# EAGLE design at86rf_mk2 (EAGLE 7.1.0)
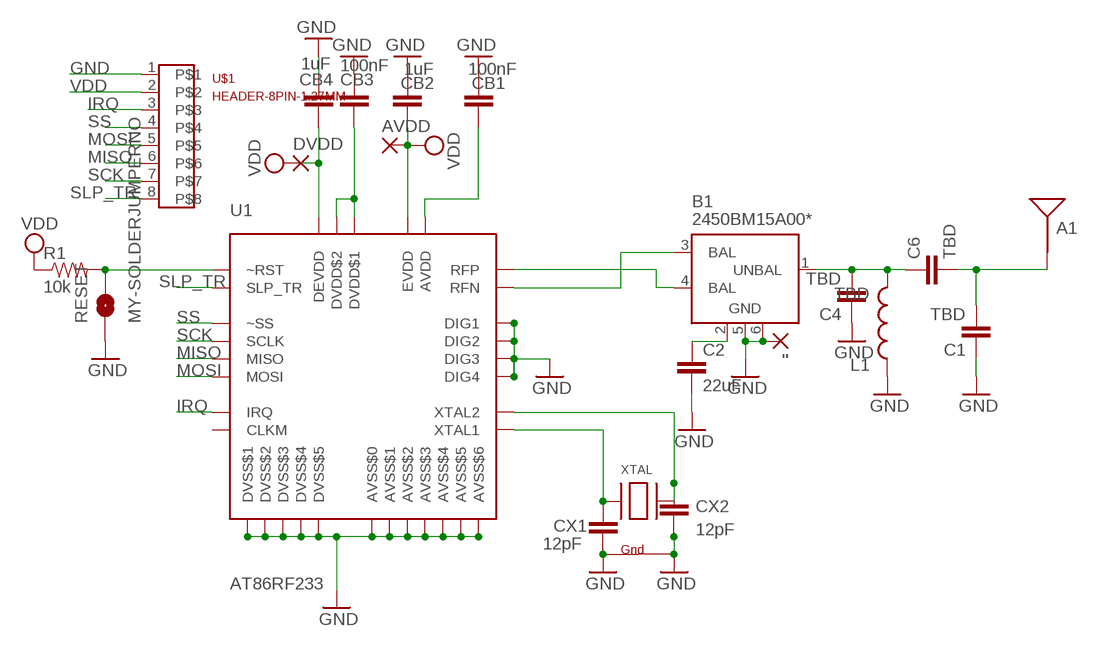
[diagram p0: schematic, sheet 1]

## Parts
'  VIAPADNOTHERMAL  [VIAPAD13MIL-NOTHERMAL]
''  VIAPADNOTHERMAL  [VIAPAD13MIL-NOTHERMAL]
A1  ANTENNA2SMD5  [ANTENNA-CHIP5]
AVDD  VIAPADNOPASTE  [PAD-1-NOPASTE]
B1  2450BM15A00*  2450BM15A00  [2450BM15A0002]
C1  TBD  CAP0402-CAP  [0402-CAP]
C2  22uF  CAP0402-CAP  [0402-CAP]
C4  TBD  CAP0402-CAP  [0402-CAP]
C6  TBD  CAP0402-CAP  [0402-CAP]
CB1  100nF  CAP0402-CAP  [0402-CAP]
CB2  1uF  CAP0603-CAP  [0603-CAP]
CB3  100nF  CAP0402-CAP  [0402-CAP]
CB4  1uF  CAP0603-CAP  [0603-CAP]
CX1  12pF  CAP0402-CAP  [0402-CAP]
CX2  12pF  CAP0402-CAP  [0402-CAP]
DVDD  VIAPADNOPASTE  [PAD-1-NOPASTE]
L1  TBD  INDUCTOR0402  [C0402]
R1  10k  RESISTOR0402-RES  [0402-RES]
RESET  MY-SOLDERJUMPERNO  [SJ_2S-NO]
U1  AT86RF233  AT86RF212BQFN32  [QFN-32]
U$1  HEADER-8PIN-1.27MM  [1X08-1.27MM]
XTAL  XTAL-4-3225  [NX3225]

## Nets
GND [power]: ''.1(P) '.1(P) B1.5(GND) B1.6(GND) C1.1 C2.2 C4.1 CB1.1 CB2.1 CB3.1 CB4.1 CX1.2 CX2.2 L1.1 RESET.1 U1.1(DIG3) U1.2(DIG4) U1.3(AVSS$1) U1.6(AVSS$2) U1.7(DVSS$1) U1.9(DIG1) U1.10(DIG2) U1.12(DVSS$2) U1.16(DVSS$3) U1.18(DVSS$4) U1.21(DVSS$5) U1.27(AVSS$3) U1.30(AVSS$4) U1.31(AVSS$5) U1.32(AVSS$6) U1.EP(AVSS$0) U$1.1 XTAL.2(G2) XTAL.4(G1)
IRQ: U1.24(IRQ) U$1.3
MISO: U1.20(MISO) U$1.6
MOSI: U1.22(MOSI) U$1.5
N$1: CB3.2 U1.13(DVDD$1) U1.14(DVDD$2)
N$2: CB1.2 U1.29(AVDD)
N$3: CX2.1 U1.25(XTAL2) XTAL.3(X2)
N$4: CX1.1 U1.26(XTAL1) XTAL.1(X1)
N$6: B1.3(BAL) U1.5(RFN)
N$7: B1.4(BAL) U1.4(RFP)
N$9 [100ohm unbal]: B1.1(UNBAL) C4.2 C6.1 L1.2
N$11: R1.2 RESET.2 U1.8(~RST)
N$14 [100ohm unbal]: A1.FEED(SIGNAL) C1.2 C6.2
N$15: B1.2(GND) C2.1
SCK: U1.19(SCLK) U$1.7
SLP_TR: U1.11(SLP_TR) U$1.8
SS: U1.23(~SS) U$1.4
VDD [power]: AVDD.P$1(P) CB2.2 CB4.2 DVDD.P$1(P) R1.1 U1.15(DEVDD) U1.28(EVDD) U$1.2
Unconnected: U1.17(CLKM)

## Library data of the parts
' '' AVDD DVDD = my library:VIAPAD: THROUGH-HOLE PAD
A1 = SparkFun-RF:ANTENNA2: Chip antenna Single endded antenna. Common with smaller chip antennas. CHIP4 package is the GPS Chip Antenna SKU: GPS-08418. CHIP5 package is 2.4GHz chip antenna SKU: WRL-00144.
B1 = my library:2450BM15A00**: 2.45 GHz Impedance Matched Balun-Filter For TI CC253X/CC2540 Chipset family Data sheet <http://www.johansontechnology.com/images/stories/ip/baluns/balun_filter_combo_matched_2450bm15a0002_v8.pdf>
C1 C2 C4 C6 = SparkFun-Passives:CAP: Capacitor Standard 0603 ceramic capacitor, and 0.1" leaded capacitor.
CB1-CB4 CX1 CX2 = SparkFun-Capacitors:CAP: Capacitor Standard 0603 ceramic capacitor, and 0.1" leaded capacitor.
L1 = SparkFun-Passives:INDUCTOR: Inductors Basic Inductor/Choke - 0603 and 1206. Footprints are not proven and vary greatly between part numbers.
R1 = SparkFun-Resistors:RESISTOR: Resistor Basic schematic elements and footprints for 0603, 1206, and PTH resistors.
RESET = my library:MY-SOLDERJUMPER: Solder Jumper Standard SMD solder jumper. Used to automate production. Two varients : Normally Open and Normally Closed are the same, but have different paste layers. NC will have a large amount of paste and should jumper during reflow.
U1 = Pinoccio:AT86RF212B
U$1 = my library:HEADER-8PIN-1.27MM
XTAL = adafruit:XTAL-4: Classic 4-pin 3.2 x 2.5mm crystal

## Net classes
1 50ohm bal: width 0.305 mm, clearance 0.203 mm
2 100ohm unbal: width 0.254 mm, clearance 0.406 mm

## Board
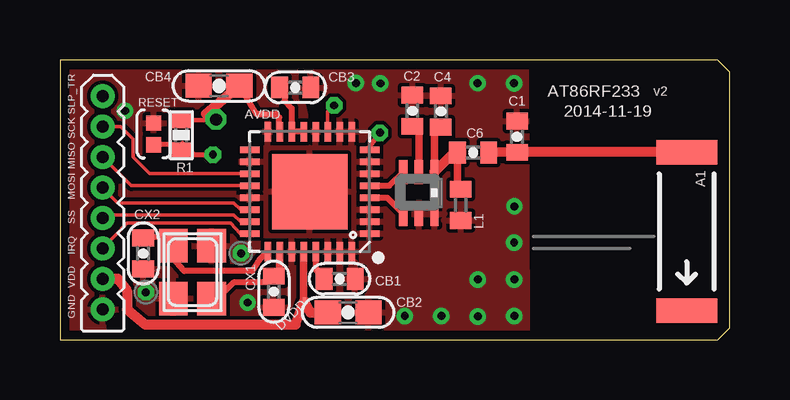
[diagram p1: board, top side]
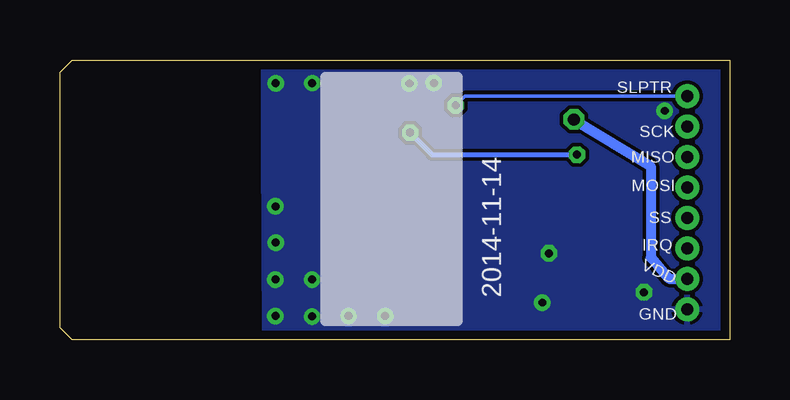
[diagram p2: board, bottom side, seen from below]

Size 27.93 x 11.67 mm. Coordinates in mm from the lower left corner, seen from the top.
Outline: 0,0 27.43,0 27.93,0.5 27.93,11.17 27.43,11.67 0,11.67 0,0
Copper layers (1*16): Top 0.0356mm / dielectric 1.5011mm / Bottom 0.0356mm
Design rules "LaenPCBOrder2 *": minimum track width 6mil, minimum drill 13mil, track to track 6mil, track to pad 6mil, pad to pad 6mil, via to via 6mil, smd to smd 6mil, copper to edge 15mil, drill to drill 6mil, minimum pad ring 7mil, minimum via ring 7mil, stop-mask expansion 4mil, vias tented up to drill 0mil, thermal gap 6mil
tRestrict: area 16.9,7.5 to 17.9,8; area 10,9.1 to 10.8,11.2; area 11.8,0.6 to 12.2,0.8; area 2,0.4 to 3.1,1; area 2.4,2.9 to 3.9,4.5; area 7.9,8.5 to 8.4,9; area 6.9,7.2 to 7.4,8; area 14.2,5.9 to 15.8,6.4

### Footprints (pad centres in the part's own frame; a part is rotated, then mirrored left to right if it is on the bottom)
VIAPAD13MIL-NOTHERMAL = drill 0.33 pad 0.686 octagon: 1 0,0
ANTENNA-CHIP5 = smd 1.016 x 2.54: FEED -3.302,0; NC 3.302,0
PAD-1-NOPASTE = smd 0.305 x 0.152: P$1 0,0
2450BM15A0002 = smd 0.35 x 1: 1 -0.65,-0.875; 2 0,-0.875; 3 0.65,-0.875; 4 0.65,0.875; 5 0,0.875; 6 -0.65,0.875
0402-CAP = smd 0.7 x 0.9: 1 -0.65,0; 2 0.65,0
0603-CAP = smd 1.1 x 1: 1 -0.85,0; 2 0.85,0
C0402 = smd 0.7 x 0.9: 1 -0.65,0; 2 0.65,0
0402-RES = smd 0.7 x 0.9: 1 -0.65,0; 2 0.65,0
SJ_2S-NO = smd 0.635 x 0.635: 1 -0.45,0; 2 0.45,0
QFN-32 = smd 0.285 x 0.8: 1 -1.75,-2.5; 2 -1.25,-2.5; 3 -0.75,-2.5; 4 -0.25,-2.5; 5 0.25,-2.5; 6 0.75,-2.5; 7 1.25,-2.5; 8 1.75,-2.5; 17 1.75,2.5; 18 1.25,2.5; 19 0.75,2.5; 20 0.25,2.5; 21 -0.25,2.5; 22 -0.75,2.5; 23 -1.25,2.5; 24 -1.75,2.5 | smd 0.8 x 0.285: 9 2.5,-1.75; 10 2.5,-1.25; 11 2.5,-0.75; 12 2.5,-0.25; 13 2.5,0.25; 14 2.5,0.75; 15 2.5,1.25; 16 2.5,1.75; 25 -2.5,1.75; 26 -2.5,1.25; 27 -2.5,0.75; 28 -2.5,0.25; 29 -2.5,-0.25; 30 -2.5,-0.75; 31 -2.5,-1.25; 32 -2.5,-1.75 | smd 3.15 x 3.15: EP 0,0
1X08-1.27MM = drill 0.508 pad 1: 1 0,0; 2 1.27,0; 3 2.54,0; 4 3.81,0; 5 5.08,0; 6 6.35,0; 7 7.62,0; 8 8.89,0
NX3225 = smd 1.4 x 1.2: 1 -1.1,-0.8; 2 1.1,-0.8; 3 1.1,0.8; 4 -1.1,0.8

### Placement (x,y rotation side)
'  7.54,3.61 0 top
''  3.58,1.98 0 top
A1  26.13,4.52 270 top
AVDD  8.51,9.42 0 top
B1  14.96,6.12 180 top
C1  19.06,8.47 270 top
C2  14.69,9.55 90 top
C4  15.88,9.53 270 top
C6  17.23,7.81 0 top
CB1  11.66,2.54 180 top
CB2  12.01,1.14 180 top
CB3  9.81,10.52 180 top
CB4  6.63,10.59 0 top
CX1  8.92,2 270 top
CX2  3.47,3.6 270 top
DVDD  10.19,1.63 90 top
L1  16.71,5.63 90 top
R1  5.05,8.53 270 top
RESET  3.91,8.59 270 top
U1  10.41,6.18 90 top
U$1  1.78,1.27 90 top
XTAL  5.53,2.82 90 top

### Tracks (layer width: path | path; a pad name or v marks a point on that pad's centre or on a via)
GND  (via drill 0.33 pad 0.33)
  other vias: 18.94,2.51 18.94,4.05 17.42,0.97 18.94,10.7 18.94,0.99 17.42,2.51 15.9,0.99 14.38,0.99 17.41,10.71 12.34,10.71 13.36,10.69 18.95,5.57 7.82,1.55 2.72,9.55
  pour Bottom (rank 2): 0,11.68 19.45,11.68 19.45,8.12 19.42,0 0,0
  pour Top (rank 3): 0,11.68 19.45,11.68 19.5,0.03 0,0
IRQ
  Top 0.152: U1.24 7.51,4.42 7.11,4.88 2.79,4.88 U$1.3
MISO
  Top 0.152: U1.20 2.97,6.43 U$1.6
MOSI
  Top 0.152: U1.22 7.53,5.42 7.24,5.71 2.41,5.71 U$1.5
N$1
  Top 0.254: U1.13 U1.14 9.66,9.66 9.36,9.97 9.36,10.32 CB3.2
N$2
  Top 0.254: U1.29 10.66,2.93 CB1.2
N$3
  Top 0.254: U1.25 8.31,3.33 8.01,2.87 5.18,2.87 4.73,3.4 XTAL.3 4.73,4.3 CX2.1
N$4
  Top 0.254: CX1.1 8.67,2.39 7.24,2.39 6.58,1.72 XTAL.1
  Top 0.305: U1.26 9.16,2.88 CX1.1
N$6
  Top 0.254: U1.5 13.74,6.43 B1.3
N$7
  Top 0.254: U1.4 13.64,5.92 B1.4
N$9
  Top 0.305: B1.1 15.61,8.61 C4.2 | C6.1 16.58,6.51 L1.2
  Top 0.406: C6.1 16.42,7.81 B1.1
N$11  (via drill 0.33 pad 0.33)
  Top 0.203: v13.33,8.64 12.88,8.03 U1.8 | v6.38,7.72 5.56,7.72 5.1,8.19 R1.2 4.85,8.13 RESET.2
  Bottom 0.203: v13.33,8.64 12.42,7.72 v6.38,7.72
N$14
  Top 0.406: A1.FEED C1.2 | 17.89,7.82 C6.2 C1.2 | C1.2
N$15
  Top 0.305: B1.2 14.96,8.63 C2.1
SCK
  Top 0.152: U1.19 3.74,6.93 3.05,7.62 3.05,8.38 2.54,8.89 U$1.7
SLP_TR  (via drill 0.33 pad 0.33)
  Top 0.152: U1.11 11.16,9.51 v11.43,9.78
  Bottom 0.152: U$1.8 11.05,10.16 v11.43,9.78
SS
  Top 0.152: U1.23 7.52,4.92 7.24,5.21 1.91,5.21 U$1.4
VDD  (via drill 0.5)
  Top 0.203: R1.1 4.92,9.17 v6.5,9.2
  Top 0.254: U1.15 9.14,8.7 9.14,9.27 9,9.41 8.2,9.41 | 8.2,9.41 CB4.2 | AVDD.P$1 8.2,9.41
  Top 0.305: DVDD.P$1 10.16,1.65 U1.28
  Top 0.406: CB4.2 6.09,9.41 v6.5,9.2 | U$1.2 2.41,2.54 2.79,2.03 2.79,1.27 3.56,0.63 9.83,0.63 DVDD.P$1 10.43,1.13 CB2.2
  Bottom 0.406: v6.5,9.2 3.3,7.24 3.3,3.43 2.54,2.54 U$1.2

### Text on the board
tPlace: 2014-11-19 | v2 | SLP_TR | SCK | MISO | MOSI | SS | IRQ | VDD | GND
bPlace: SLPTR | SCK | MISO | MOSI | SS | IRQ | VDD | 2014-11-14 | GND
tDocu: SLP_TR | SCK | MISO | MOSI | SS | IRQ | VDD | GND